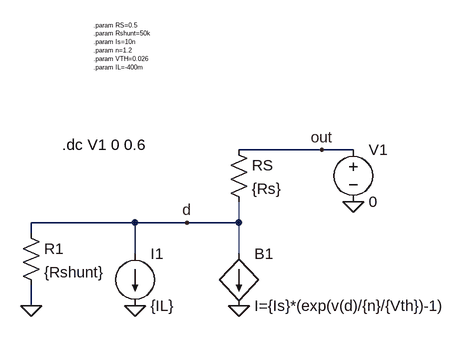
[diagram p0: schematic CheckPointC.asc]
CheckPointC.asc, the LTspice schematic file:
Version 4
SHEET 1 880 680
WIRE 304 0 176 0
WIRE 352 0 304 0
WIRE 16 112 -144 112
WIRE 96 112 16 112
WIRE 176 112 176 80
WIRE 176 112 96 112
WIRE -144 128 -144 112
WIRE 16 160 16 112
WIRE 176 160 176 112
WIRE -144 240 -144 208
FLAG 176 240 0
FLAG 16 240 0
FLAG 96 112 d
FLAG 304 0 out
FLAG 352 80 0
FLAG -144 240 0
SYMBOL bi 176 160 R0
SYMATTR InstName B1
SYMATTR Value I={Is}*(exp(v(d)/{n}/{Vth})-1)
SYMBOL current 16 160 R0
WINDOW 123 0 0 Left 0
WINDOW 39 0 0 Left 0
SYMATTR InstName I1
SYMATTR Value {IL}
SYMBOL res 160 -16 R0
SYMATTR InstName RS
SYMATTR Value {Rs}
SYMBOL res -160 112 R0
SYMATTR InstName R1
SYMATTR Value {Rshunt}
SYMBOL voltage 352 -16 R0
WINDOW 123 0 0 Left 0
WINDOW 39 0 0 Left 0
SYMATTR InstName V1
SYMATTR Value 0
TEXT -48 -192 Left 0 !.param RS=0.5\n.param Rshunt=50k\n.param Is=10n\n.param n=1.2\n.param VTH=0.026\n.param IL=-400m
TEXT -96 -8 Left 2 !.dc V1 0 0.6

The netlist it stands for:
* CheckPointC.asc
B1 d 0 I={Is}*(exp(v(d)/{n}/{Vth})-1)
I1 d 0 {IL}
RS out d {Rs}
R1 d 0 {Rshunt}
V1 out 0 0
.param RS=0.5
.param Rshunt=50k
.param Is=10n
.param n=1.2
.param VTH=0.026
.param IL=-400m
.dc V1 0 0.6
.backanno
.end